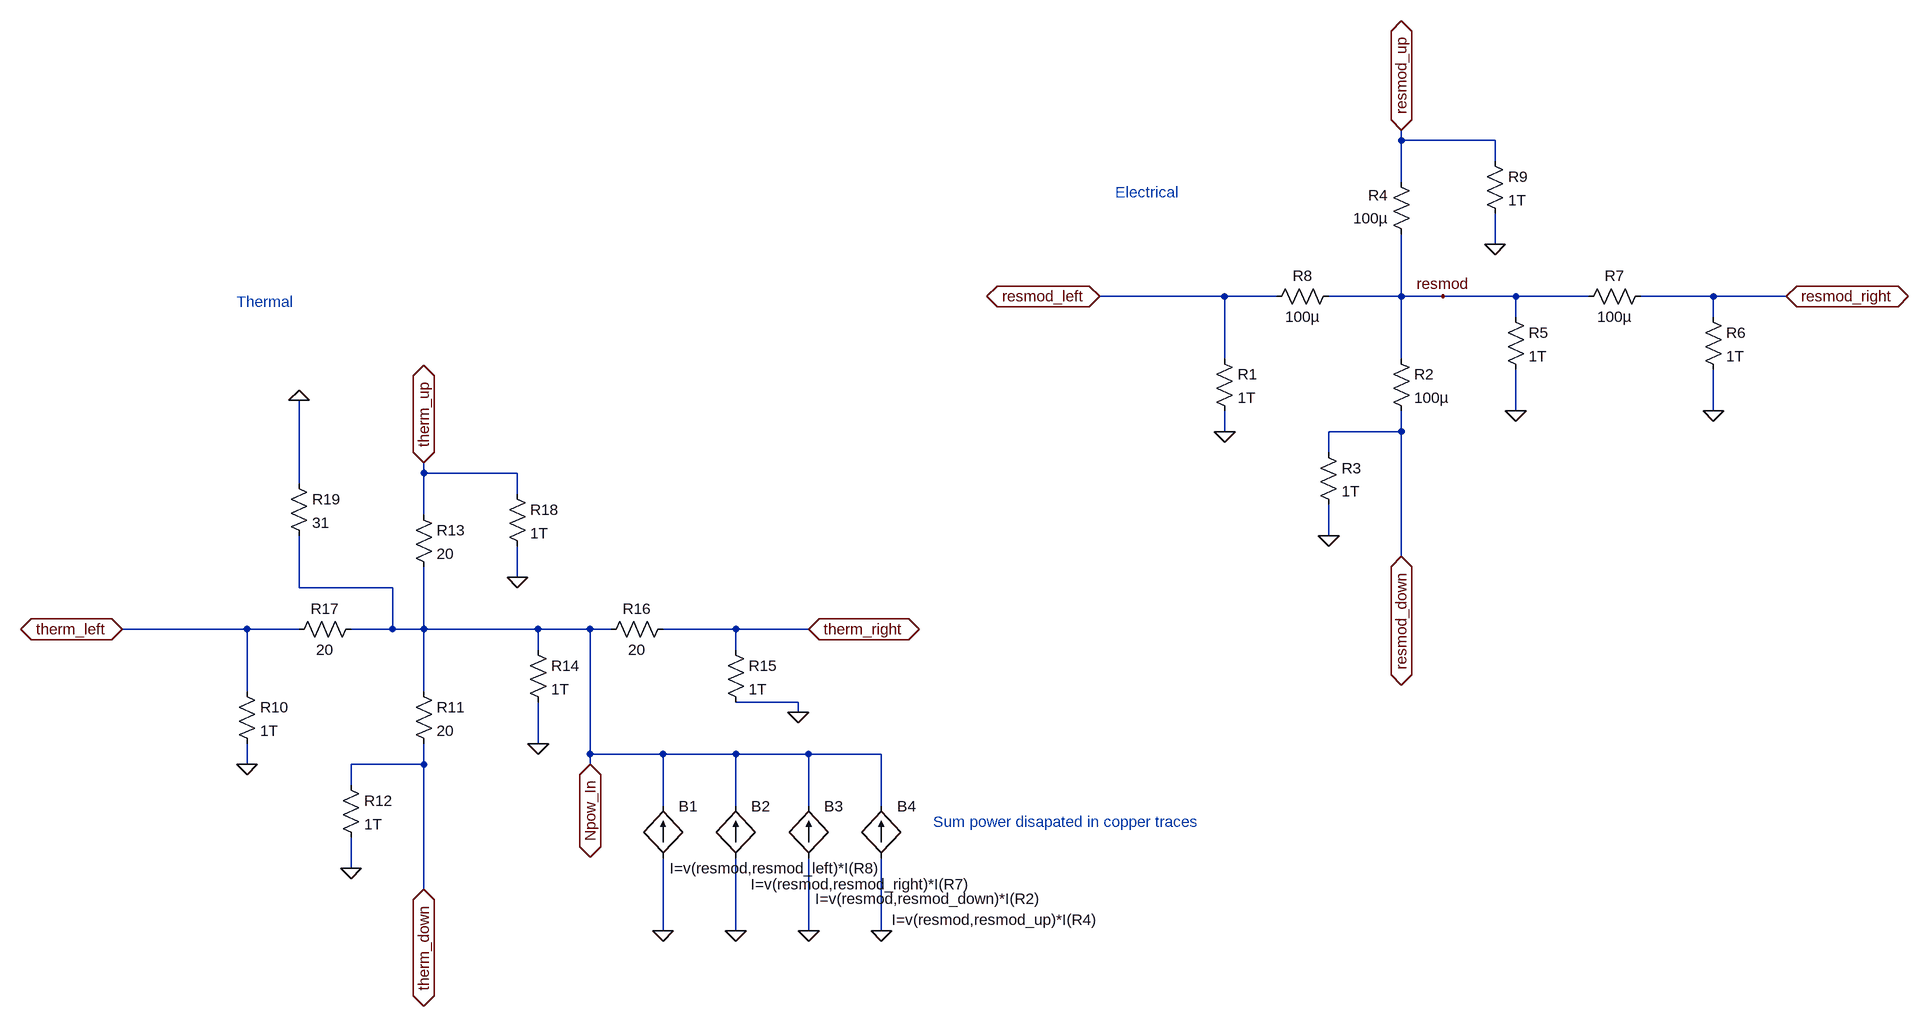
[diagram p0: schematic pcb_1x1cm2_5oz.asc]
pcb_1x1cm2_5oz.asc, the LTspice schematic file:
Version 4
SHEET 1 1224 1204
WIRE 416 -176 416 -192
WIRE 560 -176 416 -176
WIRE 560 -144 560 -176
WIRE 416 -112 416 -176
WIRE 560 -16 560 -64
WIRE 144 64 -48 64
WIRE 224 64 144 64
WIRE 416 64 416 -32
WIRE 416 64 304 64
WIRE 480 64 416 64
WIRE 592 64 480 64
WIRE 704 64 592 64
WIRE 896 64 784 64
WIRE 1008 64 896 64
WIRE 592 96 592 64
WIRE 896 96 896 64
WIRE 144 160 144 64
WIRE 416 160 416 64
WIRE 592 240 592 176
WIRE 896 240 896 176
WIRE 144 272 144 240
WIRE 416 272 416 240
WIRE 416 272 304 272
WIRE 304 304 304 272
WIRE -1088 336 -1088 320
WIRE -944 336 -1088 336
WIRE -1280 352 -1280 224
WIRE -944 368 -944 336
WIRE -1088 400 -1088 336
WIRE 304 432 304 384
WIRE 416 464 416 272
WIRE -944 496 -944 448
WIRE -1280 512 -1280 432
WIRE -1136 512 -1280 512
WIRE -1360 576 -1552 576
WIRE -1280 576 -1360 576
WIRE -1136 576 -1136 512
WIRE -1136 576 -1200 576
WIRE -1088 576 -1088 480
WIRE -1088 576 -1136 576
WIRE -912 576 -1088 576
WIRE -832 576 -912 576
WIRE -800 576 -832 576
WIRE -608 576 -720 576
WIRE -496 576 -608 576
WIRE -912 608 -912 576
WIRE -608 608 -608 576
WIRE -1360 672 -1360 576
WIRE -1088 672 -1088 576
WIRE -512 688 -608 688
WIRE -512 704 -512 688
WIRE -912 752 -912 688
WIRE -832 768 -832 576
WIRE -720 768 -832 768
WIRE -608 768 -720 768
WIRE -496 768 -608 768
WIRE -384 768 -496 768
WIRE -1360 784 -1360 752
WIRE -1088 784 -1088 752
WIRE -1088 784 -1200 784
WIRE -832 784 -832 768
WIRE -1200 816 -1200 784
WIRE -720 848 -720 768
WIRE -608 848 -608 768
WIRE -496 848 -496 768
WIRE -384 848 -384 768
WIRE -1200 944 -1200 896
WIRE -1088 976 -1088 784
WIRE -720 1040 -720 928
WIRE -608 1040 -608 928
WIRE -496 1040 -496 928
WIRE -384 1040 -384 928
FLAG 304 432 0
FLAG 144 272 0
FLAG 592 240 0
FLAG 896 240 0
FLAG -48 64 resmod_left
IOPIN -48 64 BiDir
FLAG 416 -192 resmod_up
IOPIN 416 -192 BiDir
FLAG 416 464 resmod_down
IOPIN 416 464 BiDir
FLAG 1008 64 resmod_right
IOPIN 1008 64 BiDir
FLAG 480 64 resmod
FLAG 560 -16 0
FLAG -1200 944 0
FLAG -1360 784 0
FLAG -912 752 0
FLAG -512 704 0
FLAG -1552 576 therm_left
IOPIN -1552 576 BiDir
FLAG -1088 320 therm_up
IOPIN -1088 320 BiDir
FLAG -1088 976 therm_down
IOPIN -1088 976 BiDir
FLAG -496 576 therm_right
IOPIN -496 576 BiDir
FLAG -944 496 0
FLAG -1280 224 0
FLAG -832 784 Npow_In
IOPIN -832 784 BiDir
FLAG -720 1040 0
FLAG -608 1040 0
FLAG -496 1040 0
FLAG -384 1040 0
SYMBOL res 128 144 R0
SYMATTR InstName R1
SYMATTR Value 1T
SYMBOL res 400 144 R0
SYMATTR InstName R2
SYMATTR Value 100µ
SYMBOL res 288 288 R0
SYMATTR InstName R3
SYMATTR Value 1T
SYMBOL res 432 -16 R180
WINDOW 0 36 76 Left 0
WINDOW 3 36 40 Left 0
SYMATTR InstName R4
SYMATTR Value 100µ
SYMBOL res 576 80 R0
SYMATTR InstName R5
SYMATTR Value 1T
SYMBOL res 880 80 R0
SYMATTR InstName R6
SYMATTR Value 1T
SYMBOL res 688 80 R270
WINDOW 0 32 56 VTop 0
WINDOW 3 0 56 VBottom 0
SYMATTR InstName R7
SYMATTR Value 100µ
SYMBOL res 320 48 R90
WINDOW 0 0 56 VBottom 0
WINDOW 3 32 56 VTop 0
SYMATTR InstName R8
SYMATTR Value 100µ
SYMBOL res 544 -160 R0
SYMATTR InstName R9
SYMATTR Value 1T
SYMBOL res -1376 656 R0
SYMATTR InstName R10
SYMATTR Value 1T
SYMBOL res -1104 656 R0
SYMATTR InstName R11
SYMATTR Value 20
SYMBOL res -1216 800 R0
SYMATTR InstName R12
SYMATTR Value 1T
SYMBOL res -1104 384 R0
SYMATTR InstName R13
SYMATTR Value 20
SYMBOL res -928 592 R0
SYMATTR InstName R14
SYMATTR Value 1T
SYMBOL res -624 592 R0
SYMATTR InstName R15
SYMATTR Value 1T
SYMBOL res -704 560 R90
WINDOW 0 0 56 VBottom 0
WINDOW 3 32 56 VTop 0
SYMATTR InstName R16
SYMATTR Value 20
SYMBOL res -1184 560 R90
WINDOW 0 0 56 VBottom 0
WINDOW 3 32 56 VTop 0
SYMATTR InstName R17
SYMATTR Value 20
SYMBOL res -960 352 R0
SYMATTR InstName R18
SYMATTR Value 1T
SYMBOL res -1296 336 R0
SYMATTR InstName R19
SYMATTR Value 31
SYMBOL bi2 -720 848 R0
WINDOW 3 10 96 Left 0
SYMATTR Value I=v(resmod,resmod_left)*I(R8)
SYMATTR InstName B1
SYMBOL bi2 -608 848 R0
WINDOW 3 23 120 Left 0
SYMATTR Value I=v(resmod,resmod_right)*I(R7)
SYMATTR InstName B2
SYMBOL bi2 -496 848 R0
WINDOW 3 10 143 Left 0
SYMATTR Value I=v(resmod,resmod_down)*I(R2)
SYMATTR InstName B3
SYMBOL bi2 -384 848 R0
WINDOW 3 16 175 Left 0
SYMATTR Value I=v(resmod,resmod_up)*I(R4)
SYMATTR InstName B4
TEXT -304 872 Left 0 ;Sum power disapated in copper traces
TEXT -1376 72 Left 0 ;Thermal
TEXT -24 -96 Left 0 ;Electrical

The netlist it stands for:
* pcb_1x1cm2_5oz.asc
R1 resmod_left 0 1T
R2 resmod resmod_down 100µ
R3 resmod_down 0 1T
R4 resmod resmod_up 100µ
R5 resmod 0 1T
R6 resmod_right 0 1T
R7 resmod resmod_right 100µ
R8 resmod resmod_left 100µ
R9 resmod_up 0 1T
R10 therm_left 0 1T
R11 Npow_In therm_down 20
R12 therm_down 0 1T
R13 therm_up Npow_In 20
R14 Npow_In 0 1T
R15 therm_right 0 1T
R16 therm_right Npow_In 20
R17 Npow_In therm_left 20
R18 therm_up 0 1T
R19 0 Npow_In 31
B1 0 Npow_In I=v(resmod,resmod_left)*I(R8)
B2 0 Npow_In I=v(resmod,resmod_right)*I(R7)
B3 0 Npow_In I=v(resmod,resmod_down)*I(R2)
B4 0 Npow_In I=v(resmod,resmod_up)*I(R4)
* Sum power disapated in copper traces
* Thermal
* Electrical
.backanno
.end